# EAGLE design botom_batery (EAGLE 9.6.2)
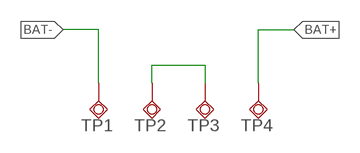
[diagram p0: schematic, sheet 1]

## Parts
TP1  TPSQB1,27  [B1,27]
TP2  TPSQB1,27  [B1,27]
TP3  TPSQB1,27  [B1,27]
TP4  TPSQB1,27  [B1,27]

## Nets
BAT+: TP4.TP
BAT-: TP1.TP
N$2: TP2.TP TP3.TP

## Library data of the parts
TP1-TP4 = testpad:TPSQ: Test pad

## Board
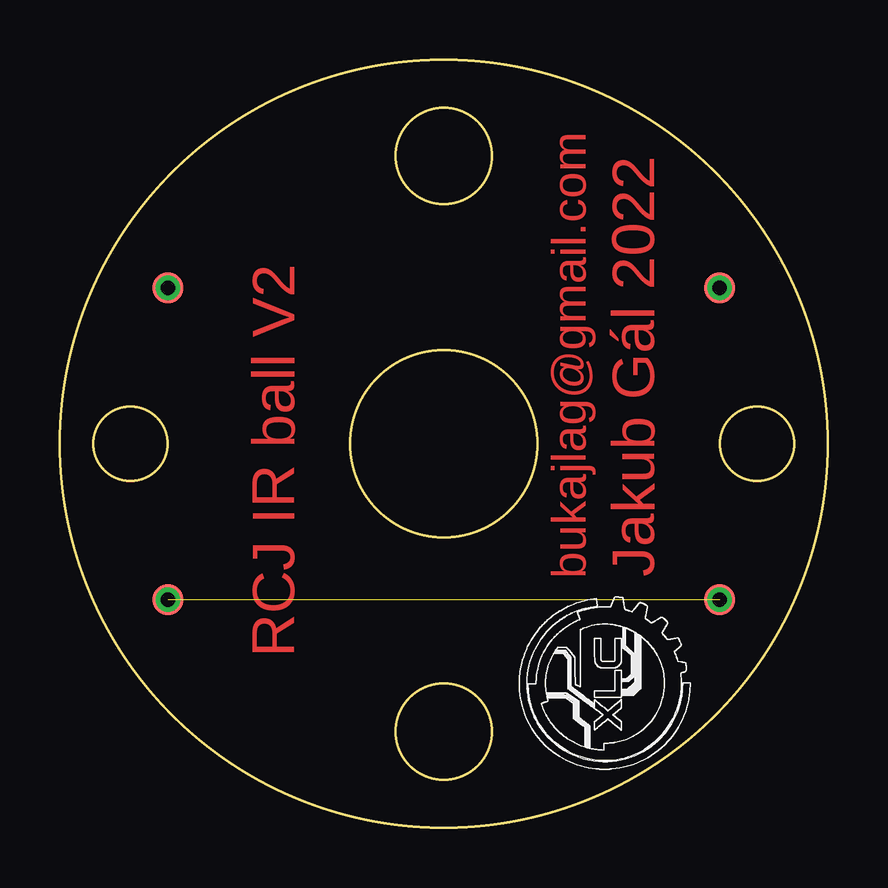
[diagram p1: board, top side]
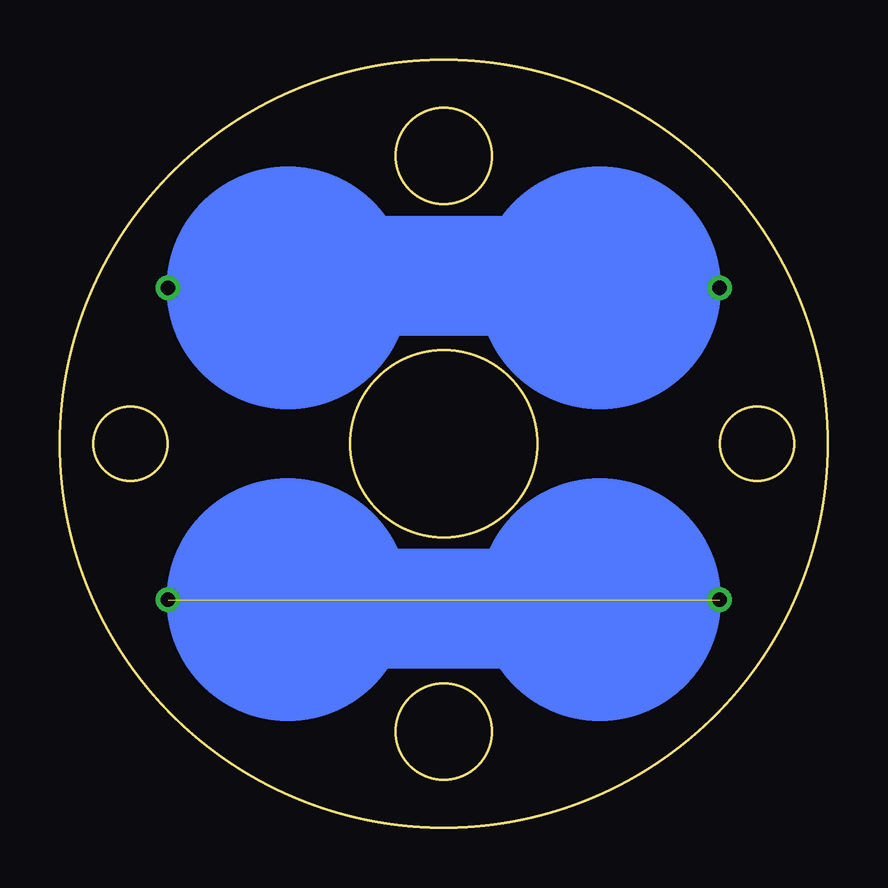
[diagram p2: board, bottom side, seen from below]

Size 32 x 32 mm. Coordinates in mm from the lower left corner, seen from the top.
Outline: circle at 2.94,16 radius 1.55
Outline: circle at 16,16 radius 3.89
Outline: circle at 29.06,16 radius 1.55
Outline: circle at 16,16 radius 16
Outline: circle at 16,28 radius 2
Outline: circle at 16,4 radius 2
Outline: circle at 16,16 radius 16
Outline: circle at 16,16 radius 3.89
Outline: circle at 2.94,16 radius 1.55
Outline: circle at 29.06,16 radius 1.55
Copper layers (1*16): Top 0.035mm / dielectric 1.5mm / Bottom 0.035mm
Design rules "default": minimum track width 6mil, minimum drill 0.35mm, track to track 6mil, track to pad 6mil, pad to pad 6mil, via to via 6mil, smd to smd 6mil, copper to edge 40mil, drill to drill 6mil, minimum pad ring 10mil, minimum via ring 8mil, stop-mask expansion 4mil, vias tented up to drill 0mil, thermal gap 10mil

### Footprints (pad centres in the part's own frame; a part is rotated, then mirrored left to right if it is on the bottom)
B1,27 = smd 1.27 x 1.27: TP 0,0

### Placement (x,y rotation side)
TP1  4.5,22.5 0 top
TP2  4.5,9.5 0 top
TP3  27.5,9.5 0 top
TP4  27.5,22.5 0 top

### Tracks (layer width: path | path; a pad name or v marks a point on that pad's centre or on a via)
BAT+  (via drill 0.6)
  other vias: 27.5,22.5
BAT-  (via drill 0.6)
  other vias: 4.5,22.5
N$1
  Bottom 5: 9.63,9.12 23.13,9.12
N$2  (via drill 0.6)  (1 unrouted)
  other vias: 27.5,9.5 4.5,9.5
N$3
  Bottom 5: 9,23.5 9.5,23
N$4
  Bottom 5: 23.5,23.5 23.01,23.01 9.13,23.01
(copper drawn outside any net)
  shapes: Bottom circle x4

### Text on the board
Top: bukajlag@gmail.com | Jakub Gál 2022 | RCJ IR ball V2
tStop: bukajlag@gmail.com | Jakub Gál 2022 | RCJ IR ball V2